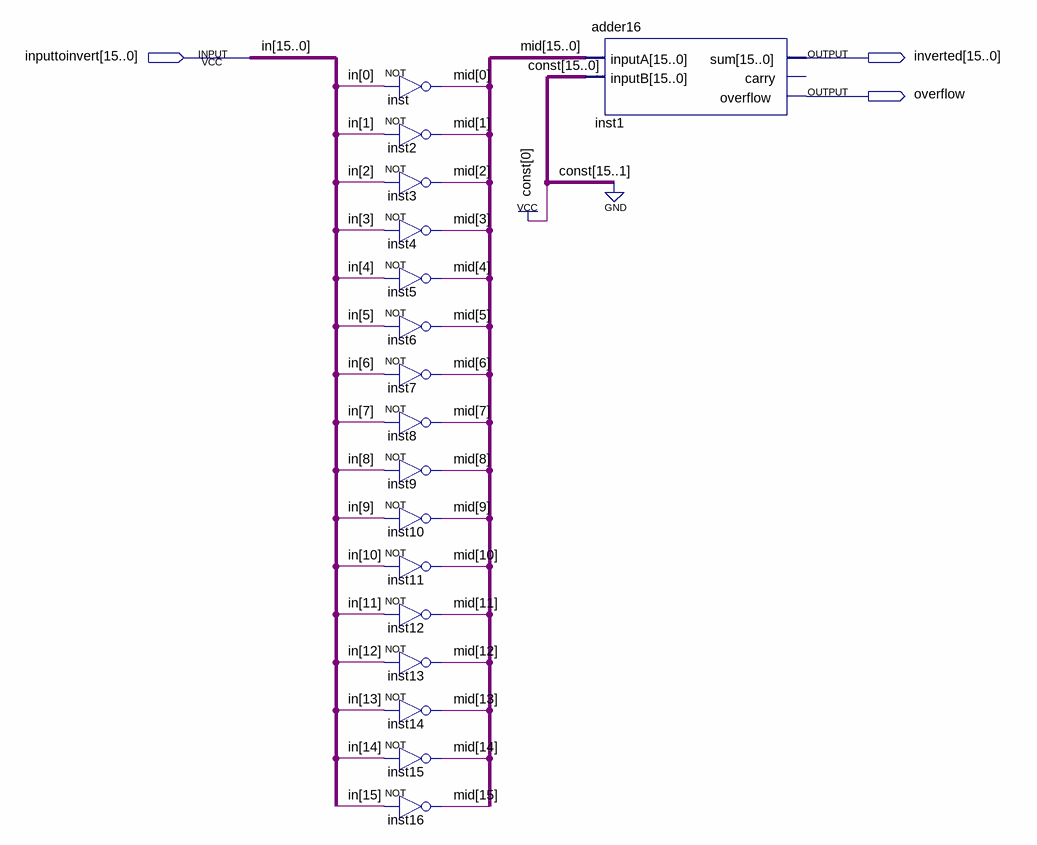
[diagram p0: schematic sheet]
// Quartus schematic signInversion.bdf as structural Verilog: 17 symbols, 3 pins
module signInversion (
  input  [15:0] inputtoinvert,
  output [15:0] inverted,
  output overflow
);

  wire [15:0] mid;

  not inst (mid[0], inputtoinvert[0]);
  not inst2 (mid[1], inputtoinvert[1]);
  not inst3 (mid[2], inputtoinvert[2]);
  not inst4 (mid[3], inputtoinvert[3]);
  not inst5 (mid[4], inputtoinvert[4]);
  not inst6 (mid[5], inputtoinvert[5]);
  not inst7 (mid[6], inputtoinvert[6]);
  not inst8 (mid[7], inputtoinvert[7]);
  not inst9 (mid[8], inputtoinvert[8]);
  not inst10 (mid[9], inputtoinvert[9]);
  not inst11 (mid[10], inputtoinvert[10]);
  not inst12 (mid[11], inputtoinvert[11]);
  not inst13 (mid[12], inputtoinvert[12]);
  not inst14 (mid[13], inputtoinvert[13]);
  not inst15 (mid[14], inputtoinvert[14]);
  not inst16 (mid[15], inputtoinvert[15]);
  adder16 inst1 (.inputA(mid), .inputB(16'b0000000000000001), .sum(inverted), .overflow(overflow));  // open: carry

  // Other names for the same wires on the sheet: in[15:0] = inputtoinvert
endmodule
